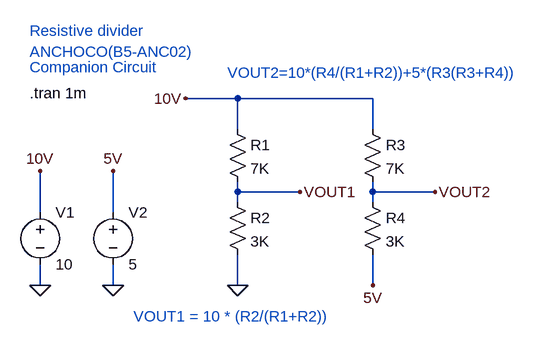
[diagram p0: schematic resistive_divider.asc]
resistive_divider.asc, the LTspice schematic file:
Version 4
SHEET 1 1056 680
WIRE 368 64 288 64
WIRE 576 64 368 64
WIRE 368 112 368 64
WIRE 576 112 576 64
WIRE 368 208 368 192
WIRE 464 208 368 208
WIRE 576 208 576 192
WIRE 672 208 576 208
WIRE 368 224 368 208
WIRE 576 224 576 208
WIRE 64 240 64 176
WIRE 176 240 176 176
WIRE 64 352 64 320
WIRE 176 352 176 320
WIRE 368 352 368 304
WIRE 576 352 576 304
FLAG 64 352 0
FLAG 176 352 0
FLAG 64 176 10V
FLAG 176 176 5V
FLAG 368 352 0
FLAG 288 64 10V
FLAG 464 208 VOUT1
FLAG 672 208 VOUT2
FLAG 576 352 5V
SYMBOL voltage 64 224 R0
WINDOW 123 0 0 Left 0
WINDOW 39 0 0 Left 0
SYMATTR InstName V1
SYMATTR Value 10
SYMBOL voltage 176 224 R0
WINDOW 123 0 0 Left 0
WINDOW 39 0 0 Left 0
SYMATTR InstName V2
SYMATTR Value 5
SYMBOL res 352 96 R0
SYMATTR InstName R1
SYMATTR Value 7K
SYMBOL res 352 208 R0
SYMATTR InstName R2
SYMATTR Value 3K
SYMBOL res 560 96 R0
SYMATTR InstName R3
SYMATTR Value 7K
SYMBOL res 560 208 R0
SYMATTR InstName R4
SYMATTR Value 3K
TEXT 48 -40 Left 2 ;Resistive divider
TEXT 48 -8 Left 2 ;ANCHOCO(B5-ANC02)
TEXT 48 16 Left 2 ;Companion Circuit
TEXT 48 56 Left 2 !.tran 1m
TEXT 208 400 Left 2 ;VOUT1 = 10 * (R2/(R1+R2))
TEXT 352 24 Left 2 ;VOUT2=10*(R4/(R1+R2))+5*(R3(R3+R4))

The netlist it stands for:
* resistive_divider.asc
V1 10V 0 10
V2 5V 0 5
R1 10V VOUT1 7K
R2 VOUT1 0 3K
R3 10V VOUT2 7K
R4 VOUT2 5V 3K
* Resistive divider
* ANCHOCO(B5-ANC02)
* Companion Circuit
.tran 1m
* VOUT1 = 10 * (R2/(R1+R2))
* VOUT2=10*(R4/(R1+R2))+5*(R3(R3+R4))
.backanno
.end